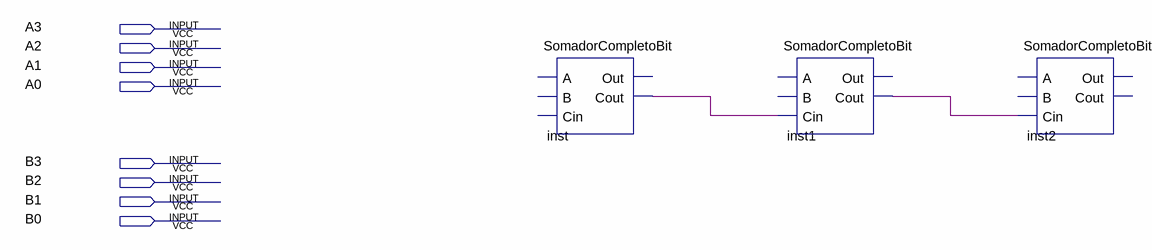
[diagram p0: schematic sheet]
// Quartus schematic MultCompleto.bdf as structural Verilog: 3 symbols, 8 pins
module MultCompleto (
  input  A3,
  input  A2,
  input  A1,
  input  A0,
  input  B3,
  input  B2,
  input  B1,
  input  B0
);

  wire inst1_cout, inst_cout;

  SomadorCompletoBit inst (.Cout(inst_cout));  // open: A, B, Cin, Out
  SomadorCompletoBit inst1 (.Cin(inst_cout), .Cout(inst1_cout));  // open: A, B, Out
  SomadorCompletoBit inst2 (.Cin(inst1_cout));  // open: A, B, Out, Cout
endmodule
